# EAGLE design ETH7820 with ESP32 (EAGLE 9.0.1)
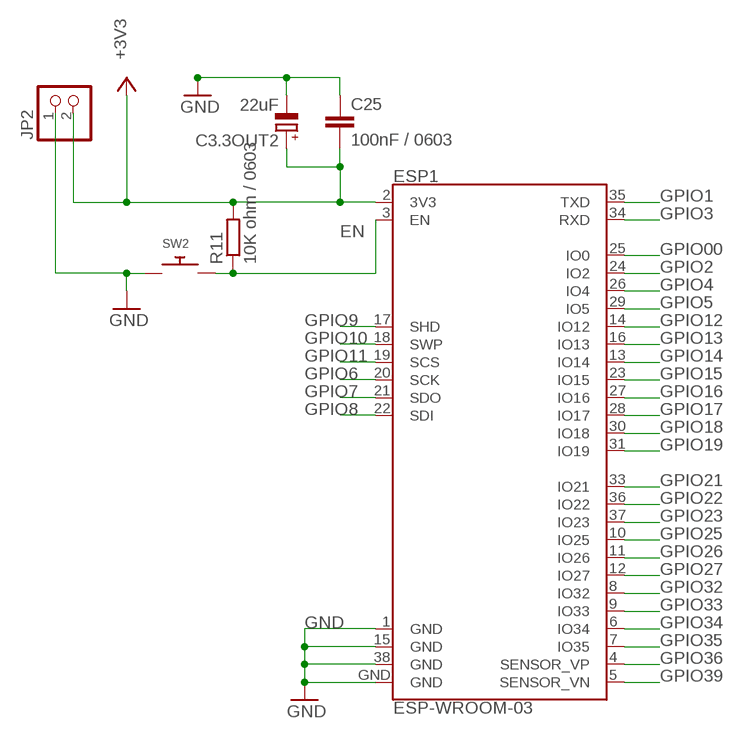
[diagram p0: schematic, sheet 1, part 1 of 2]
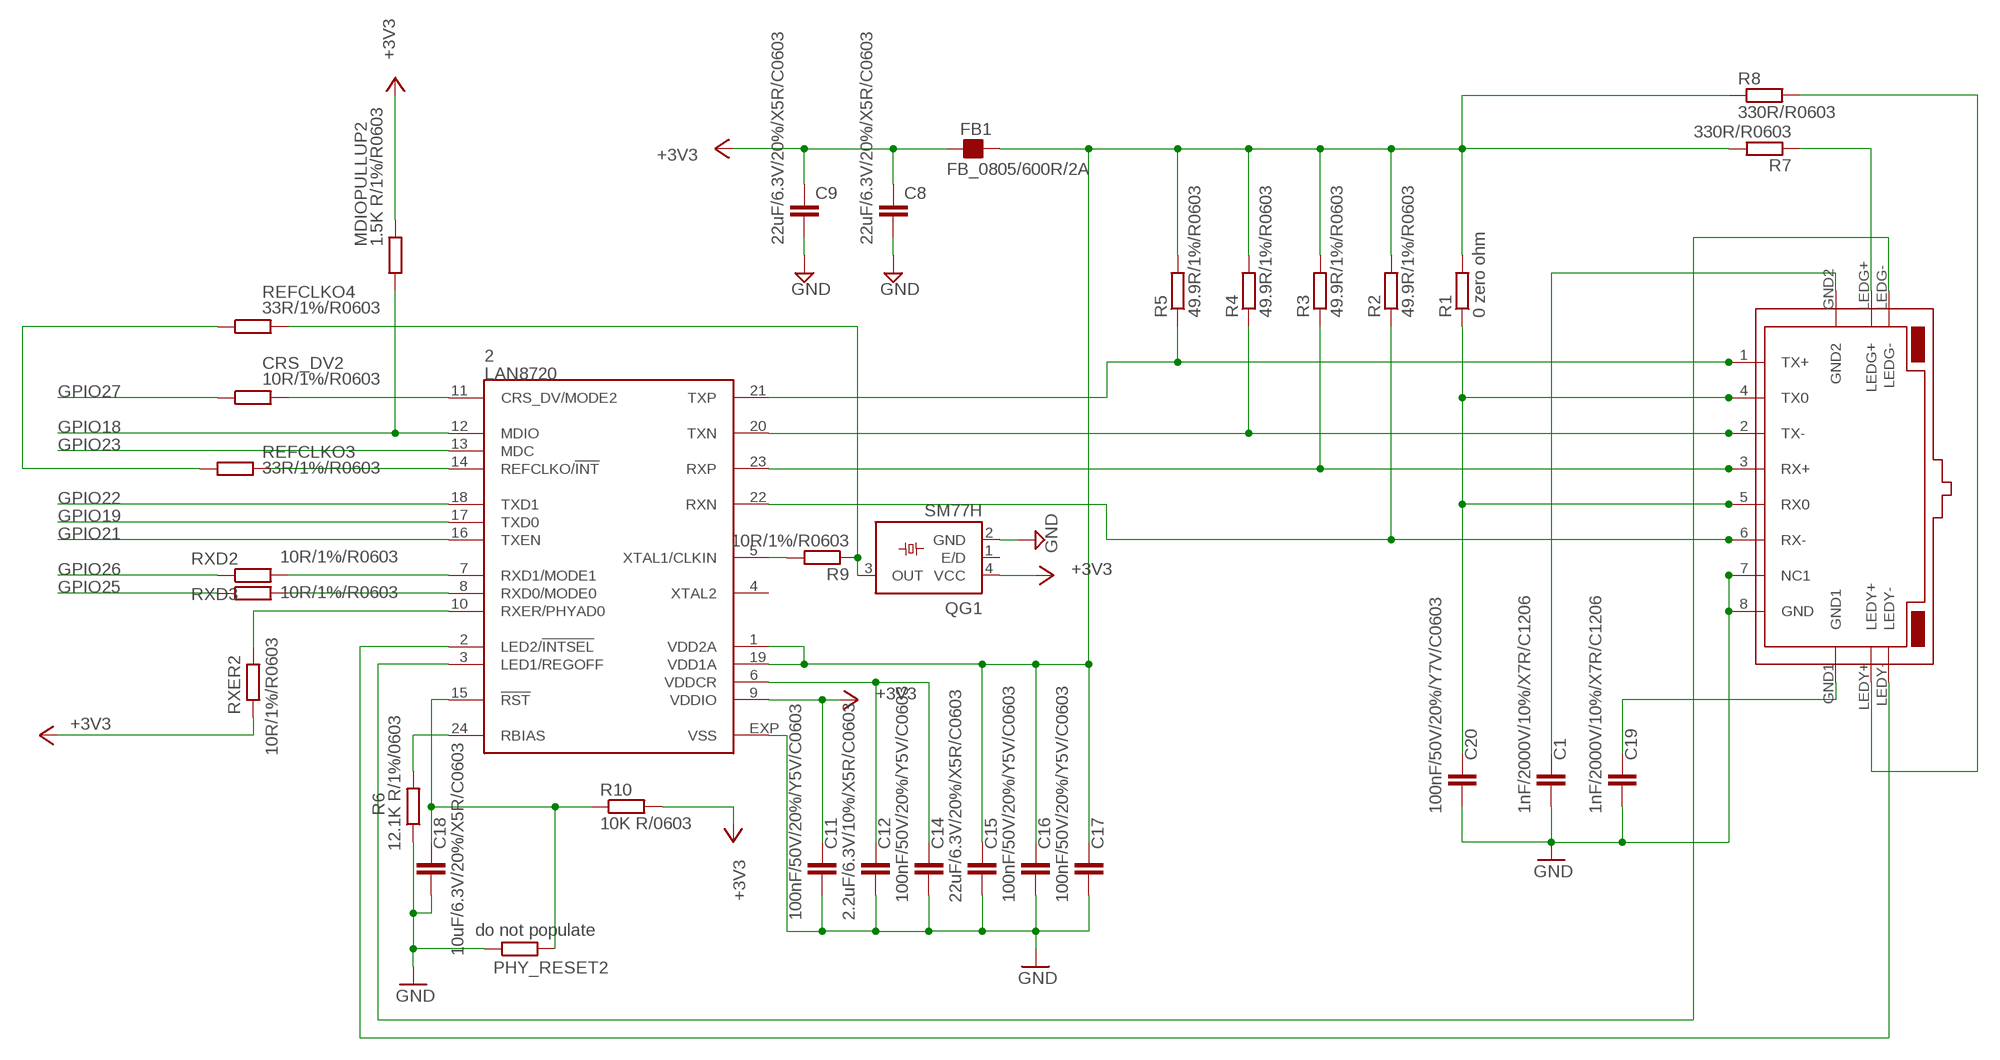
[diagram p1: schematic, sheet 1, part 2 of 2]

## Parts
2  LAN8720  [QFN24]
C1  1nF/2000V/10%/X7R/C1206  C-EUC1206  [C1206]
C3.3OUT2  22uF  CPOL-EU153CLV-0605  [153CLV-0605]
C8  22uF/6.3V/20%/X5R/C0603  C-EUC0603  [C0603]
C9  22uF/6.3V/20%/X5R/C0603  C-EUC0603  [C0603]
C11  100nF/50V/20%/Y5V/C0603  C-EUC0603  [C0603]
C12  2.2uF/6.3V/10%/X5R/C0603  C-EUC0603  [C0603]
C14  100nF/50V/20%/Y5V/C0603  C-EUC0603  [C0603]
C15  22uF/6.3V/20%/X5R/C0603  C-EUC0603  [C0603]
C16  100nF/50V/20%/Y5V/C0603  C-EUC0603  [C0603]
C17  100nF/50V/20%/Y5V/C0603  C-EUC0603  [C0603]
C18  10uF/6.3V/20%/X5R/C0603  C-EUC0603  [C0603]
C19  1nF/2000V/10%/X7R/C1206  C-EUC1206  [C1206]
C20  100nF/50V/20%/Y7V/C0603  C-EUC0603  [C0603]
C25  100nF / 0603  C-EUC0603  [C0603]
CRS_DV2  10R/1%/R0603  R-EU_R0603  [R0603]
ESP1  ESP-WROOM-03  [ESP-WROOM-03]
FB1  FB_0805/600R/2A  FB_0805  [L0805]
JP2  PINHD-1X2  [1X02]
MDIOPULLUP2  1.5K R/1%/R0603  R-EU_R0603  [R0603]
PHY_RESET2  do not populate  R-EU_R0603  [R0603]
QG1  SM77H  [SM77H]
R1  0 zero ohm  R-EU_R0603  [R0603]
R2  49.9R/1%/R0603  R-EU_R0603  [R0603]
R3  49.9R/1%/R0603  R-EU_R0603  [R0603]
R4  49.9R/1%/R0603  R-EU_R0603  [R0603]
R5  49.9R/1%/R0603  R-EU_R0603  [R0603]
R6  12.1K R/1%/0603  R-EU_R0603  [R0603]
R7  330R/R0603  R-EU_R0603  [R0603]
R8  330R/R0603  R-EU_R0603  [R0603]
R9  10R/1%/R0603  R-EU_R0603  [R0603]
R10  10K R/0603  R-EU_R0603  [R0603]
R11  10K ohm / 0603  R-EU_R0603  [R0603]
REFCLKO3  33R/1%/R0603  R-EU_R0603  [R0603]
REFCLKO4  33R/1%/R0603  R-EU_R0603  [R0603]
RJ2  RJ45-TRAFO-L  [RJ45-TRAFO-L]
RXD2  10R/1%/R0603  R-EU_R0603  [R0603]
RXD3  10R/1%/R0603  R-EU_R0603  [R0603]
RXER2  10R/1%/R0603  R-EU_R0603  [R0603]
SW2  SWITCH_PUSHBUTTONEVQ-PE  [TACT_PANA-EVQ]

## Nets
+3V3: 2.9(VDDIO) C3.3OUT2.+ C8.1 C9.1 C11.1 C25.2 ESP1.2(3V3) FB1.1 JP2.2 MDIOPULLUP2.2 QG1.4(VCC) R10.2 R11.2 RXER2.2
EN: ESP1.3(EN) R11.1 SW2.P$2
GND: 2.EXP(VSS) C1.2 C3.3OUT2.- C8.2 C9.2 C11.2 C12.2 C14.2 C15.2 C16.2 C17.2 C18.2 C19.2 C20.2 C25.1 ESP1.1(GND) ESP1.15(GND) ESP1.38(GND) ESP1.GND JP2.1 PHY_RESET2.1 QG1.2(GND) R6.1 RJ2.7(NC1) RJ2.8(GND) SW2.P$1
GPIO00: ESP1.25(IO0)
GPIO1: ESP1.35(TXD)
GPIO2: ESP1.24(IO2)
GPIO3: ESP1.34(RXD)
GPIO4: ESP1.26(IO4)
GPIO5: ESP1.29(IO5)
GPIO6: ESP1.20(SCK)
GPIO7: ESP1.21(SDO)
GPIO8: ESP1.22(SDI)
GPIO9: ESP1.17(SHD)
GPIO10: ESP1.18(SWP)
GPIO11: ESP1.19(SCS)
GPIO12: ESP1.14(IO12)
GPIO13: ESP1.16(IO13)
GPIO14: ESP1.13(IO14)
GPIO15: ESP1.23(IO15)
GPIO16: ESP1.27(IO16)
GPIO17: ESP1.28(IO17)
GPIO18: 2.12(MDIO) ESP1.30(IO18) MDIOPULLUP2.1
GPIO19: 2.17(TXD0) ESP1.31(IO19)
GPIO21: 2.16(TXEN) ESP1.33(IO21)
GPIO22: 2.18(TXD1) ESP1.36(IO22)
GPIO23: 2.13(MDC) ESP1.37(IO23)
GPIO25: ESP1.10(IO25) RXD3.1
GPIO26: ESP1.11(IO26) RXD2.1
GPIO27: CRS_DV2.1 ESP1.12(IO27)
GPIO32: ESP1.8(IO32)
GPIO33: ESP1.9(IO33)
GPIO34: ESP1.6(IO34)
GPIO35: ESP1.7(IO35)
GPIO36: ESP1.4(SENSOR_VP)
GPIO39: ESP1.5(SENSOR_VN)
N$1: 2.20(TXN) R4.1 RJ2.2(TX-)
N$2: 2.21(TXP) R5.1 RJ2.1(TX+)
N$3: 2.23(RXP) R3.1 RJ2.3(RX+)
N$4: 2.24(RBIAS) R6.2
N$5: 2.2(LED2/!INTSEL) RJ2.LEDY-
N$6: 2.22(RXN) R2.1 RJ2.6(RX-)
N$7: 2.1(VDD2A) 2.19(VDD1A) C15.1 C16.1 C17.1 FB1.2 R1.2 R2.2 R3.2 R4.2 R5.2 R7.2 R8.1
N$8: 2.6(VDDCR) C12.1 C14.1
N$9: 2.5(XTAL1/CLKIN) R9.2
N$10: 2.11(CRS_DV/MODE2) CRS_DV2.2
N$11: 2.14(REFCLKO/!INT) REFCLKO3.2
N$12: 2.7(RXD1/MODE1) RXD2.2
N$13: 2.8(RXD0/MODE0) RXD3.2
N$14: 2.10(RXER/PHYAD0) RXER2.1
N$15: 2.15(!RST) C18.1 PHY_RESET2.2 R10.1
N$16: C20.1 R1.1 RJ2.4(TX0) RJ2.5(RX0)
N$17: C19.1 RJ2.GND1
N$18: C1.1 RJ2.GND2
N$19: R7.1 RJ2.LEDG+
N$20: 2.3(LED1/REGOFF) RJ2.LEDG-
N$21: REFCLKO3.1 REFCLKO4.1
N$22: R8.2 RJ2.LEDY+
N$23: QG1.3(OUT) R9.1 REFCLKO4.2
Unconnected: 2.4(XTAL2) QG1.1(E/D)

## Library data of the parts
2 = microchip-smsc-lan8720:LAN8720: LAN8720A/LAN8720Ai Small Footprint RMII 10/100 Ethernet PHY Transceiver with HP Auto-MDIX Support from SMSC / Microchip <http://www.microchip.com>. (C) 2014 Tomasz Boleslaw CEDRO, cederom@tlen.pl, http://www.tomek.cedro.info. Version 0.1 (2014-01-04): Initial release.
C1 C8 C9 C11 C12 C14-C20 C25 = rcl:C-EU: CAPACITOR, European symbol; SPICEPREFIX: C
C3.3OUT2 = rcl:CPOL-EU: POLARIZED CAPACITOR, European symbol; SPICEPREFIX: C
CRS_DV2 MDIOPULLUP2 PHY_RESET2 R1-R11 REFCLKO3 REFCLKO4 RXD2 RXD3 RXER2 = rcl:R-EU_: RESISTOR, European symbol; SPICEPREFIX: R
ESP1 = esp32:ESP-WROOM-03
FB1 = rc-master-smd:FB_: FERRITE BEAD
JP2 = pinhead:PINHD-1X2: PIN HEADER
QG1 = crystal:SM77H: 3.3V CMOS Clock Oscillator Source: www.pletronics.com .. sm77h%203.3v.pdf; OC_FARNELL: unknown; OC_NEWARK: unknown
RJ2 = con-amphenol-rj45-ld:RJ45-TRAFO-L: RJ45 socket with integrated magnetics and LEDs Naming: Amphenol LMJ1998824110DL1T39J TME RJ45-TRAFO-L Author: Petr Kalandra <mailto:kalandrap@gmail.com> Datasheet: http://zefiryn.tme.pl/dok/zlacza/rjtrafol.PDF
SW2 = Adafruit:SWITCH_PUSHBUTTON: Buttons SOFTTOUCHSMD_SJ - Soft touch temporary push button (Super Junk Akihabara) Compatible with SKPMANE010 [Mouser: 688-SKPMAN] C&K_KSS = Digikey: KSS221GLFS

## Board
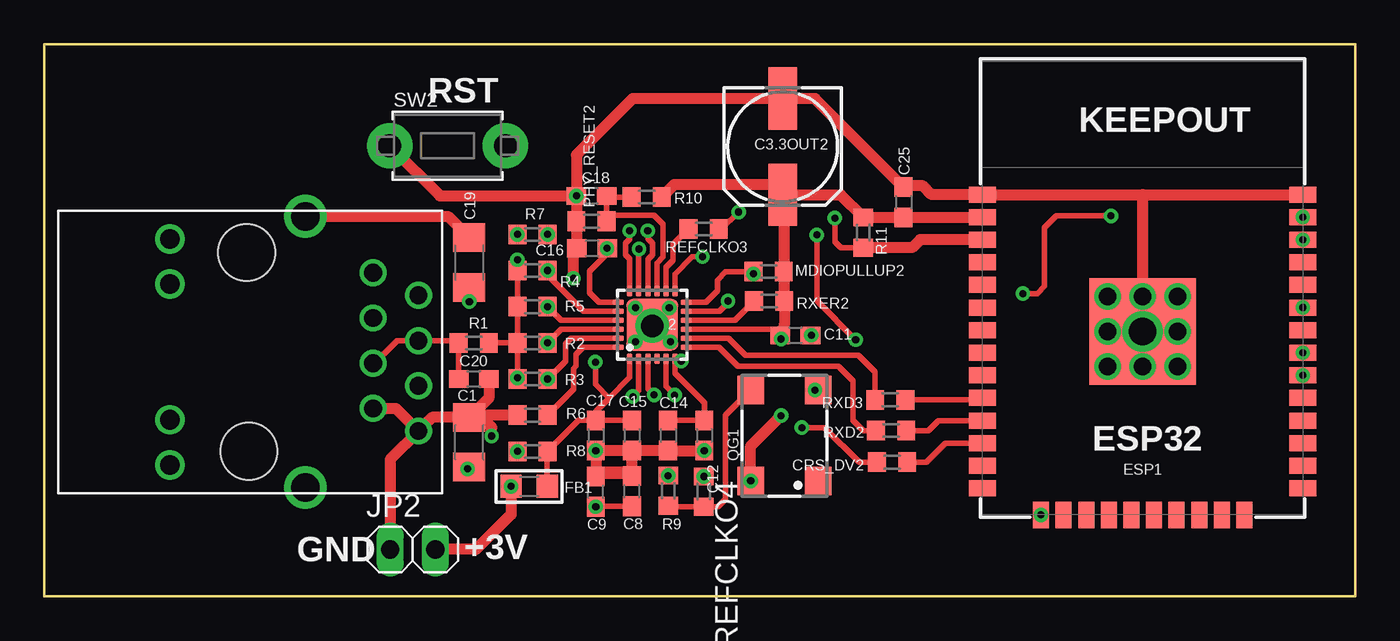
[diagram p2: board, top side]
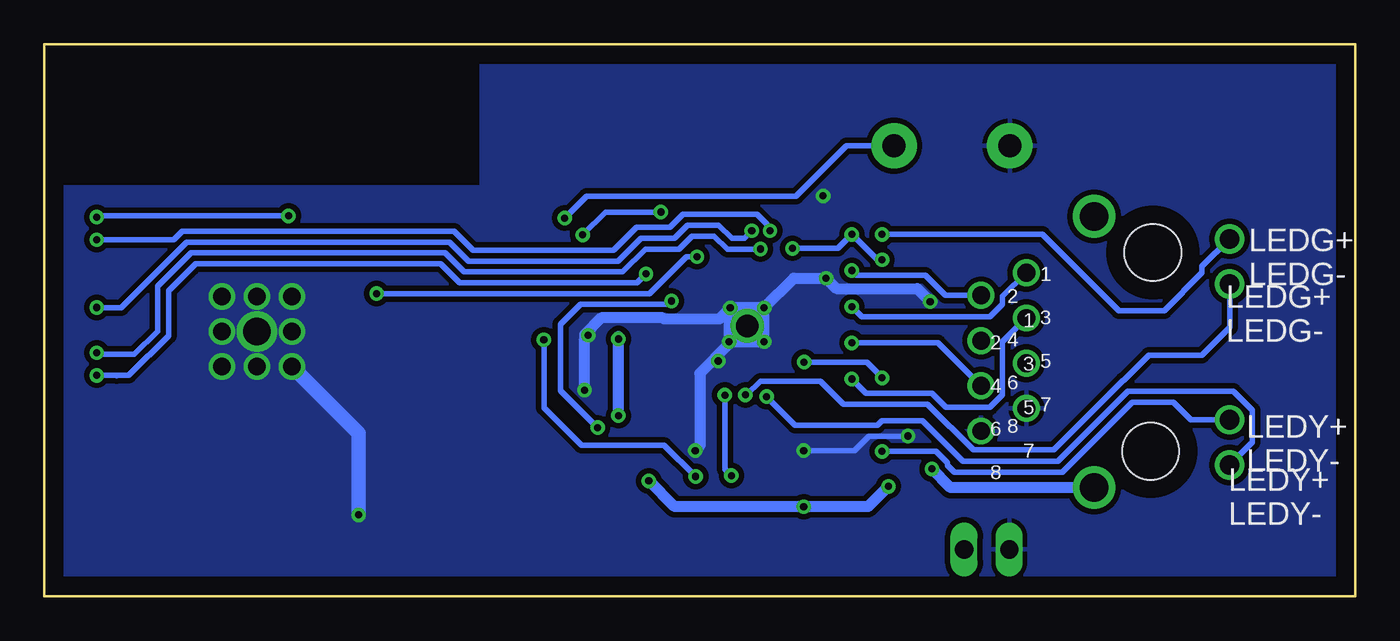
[diagram p3: board, bottom side, seen from below]

Size 73.66 x 30.99 mm. Coordinates in mm from the lower left corner, seen from the top.
Outline: 0,30.99 0,0 73.66,0 73.66,30.99 0,30.99
Copper layers (1*16): Top 0.035mm / dielectric 1.5mm / Bottom 0.035mm
Design rules "default": minimum track width 6mil, minimum drill 0.35mm, track to track 6mil, track to pad 6mil, pad to pad 6mil, via to via 6mil, smd to smd 6mil, copper to edge 40mil, drill to drill 6mil, minimum pad ring 10mil, minimum via ring 8mil, stop-mask expansion 4mil, vias tented up to drill 0mil, thermal gap 10mil

### Footprints (pad centres in the part's own frame; a part is rotated, then mirrored left to right if it is on the bottom)
QFN24 = smd 0.6 x 0.3: 1 -1.905,1.27; 2 -1.905,0.762; 3 -1.905,0.254; 4 -1.905,-0.254; 5 -1.905,-0.762; 6 -1.905,-1.27; 13 1.905,-1.27; 14 1.905,-0.762; 15 1.905,-0.254; 16 1.905,0.254; 17 1.905,0.762; 18 1.905,1.27 | smd 0.3 x 0.6: 7 -1.27,-1.905; 8 -0.762,-1.905; 9 -0.254,-1.905; 10 0.254,-1.905; 11 0.762,-1.905; 12 1.27,-1.905; 19 1.27,1.905; 20 0.762,1.905; 21 0.254,1.905; 22 -0.254,1.905; 23 -0.762,1.905; 24 -1.27,1.905 | smd 2.9 x 2.9: EXP 0,0
C1206 = smd 1.6 x 1.8: 1 -1.4,0; 2 1.4,0
153CLV-0605 = smd 3.5 x 1.6: + 2.7,0; - -2.7,0
C0603 = smd 1.1 x 1: 1 -0.85,0; 2 0.85,0
R0603 = smd 1 x 1.1: 1 -0.85,0; 2 0.85,0
ESP-WROOM-03 = smd 0.9 x 1.5: 1 7.7,9; 2 6.43,9; 3 5.16,9; 4 3.89,9; 5 2.62,9; 6 1.35,9; 7 0.08,9; 8 -1.19,9; 9 -2.46,9; 10 -3.73,9; 11 -5,9; 12 -6.27,9; 13 -7.54,9; 14 -8.81,9; 25 -8.81,-9; 26 -7.54,-9; 27 -6.27,-9; 28 -5,-9; 29 -3.73,-9; 30 -2.46,-9; 31 -1.19,-9; 32 0.08,-9; 33 1.35,-9; 34 2.62,-9; 35 3.89,-9; 36 5.16,-9; 37 6.43,-9; 38 7.7,-9 | smd 1.5 x 0.9: 15 -10.3,5.715; 16 -10.3,4.445; 17 -10.3,3.175; 18 -10.3,1.905; 19 -10.3,0.635; 20 -10.3,-0.635; 21 -10.3,-1.905; 22 -10.3,-3.175; 23 -10.3,-4.445; 24 -10.3,-5.715 | smd 6 x 6: GND 0,0
L0805 = smd 1.2 x 1.3: 1 -1.016,0; 2 1.016,0
1X02 = drill 1.016 long: 1 -1.27,0; 2 1.27,0
SM77H = smd 1.6 x 1.5: 1 -2.55,-1.9; 2 2.55,-1.9; 3 2.55,1.9; 4 -2.55,1.9
RJ45-TRAFO-L = drill 1: 1 -4.445,6.35; 2 -3.175,8.89; 3 -1.905,6.35; 4 -0.635,8.89; 5 0.635,6.35; 6 1.905,8.89; 7 3.175,6.35; 8 4.445,8.89 | drill 1.6: GND1 -7.62,2.54; GND2 7.62,2.54 | drill 1.1: LEDG+ -6.35,-5.08; LEDG- -3.81,-5.08; LEDY+ 3.81,-5.08; LEDY- 6.35,-5.08 | hole 3.2: -5.588,-0.762; 5.588,-0.635
TACT_PANA-EVQ = drill 1.3 pad 2.54: P$1 -3.25,0; P$2 3.25,0

### Placement (x,y rotation side)
2  34.16,15.24 90 top
C1  23.88,8.64 90 top
C3.3OUT2  41.49,25.25 270 top
C8  33.02,5.89 90 top
C9  30.99,5.87 90 top
C11  42.2,14.64 0 top
C12  37.08,9.02 270 top
C14  35.05,9.02 270 top
C15  33.02,9.02 270 top
C16  30.77,19.53 180 top
C17  30.99,9.02 270 top
C18  30.75,22.48 180 top
C19  23.88,18.73 270 top
C20  24.13,12.19 0 top
C25  48.29,22.12 270 top
CRS_DV2  47.64,7.52 180 top
ESP1  61.72,14.86 90 top
FB1  27.24,6.16 0 top
JP2  20.7,2.62 0 top
MDIOPULLUP2  40.7,18.22 0 top
PHY_RESET2  30.75,21.06 0 top
QG1  41.59,9.02 90 top
R1  24.13,14.22 0 top
R2  27.43,14.22 180 top
R3  27.43,12.19 180 top
R4  27.43,18.29 180 top
R5  27.43,16.26 180 top
R6  27.43,10.16 0 top
R7  27.43,20.32 0 top
R8  27.43,8.13 180 top
R9  35.05,5.92 90 top
R10  33.85,22.42 0 top
R11  46.02,20.42 90 top
REFCLKO3  37.05,20.62 180 top
REFCLKO4  37.06,5.87 270 top
RJ2  12.13,13.72 270 top
RXD2  47.59,9.3 180 top
RXD3  47.54,11.02 180 top
RXER2  40.73,16.57 0 top
SW2  22.66,25.3 0 top

### Tracks (layer width: path | path; a pad name or v marks a point on that pad's centre or on a via)
+3V3  (via drill 0.4)
  Top 0.152: C11.1 41.4,14.64 v41.4,14.44
  Top 0.305: C8.1 31.01,5.04 C9.1 | v41.4,14.44 41.31,14.99 2.9
  Top 0.406: 41.58,15.25 41.35,15.02 v41.4,14.44
  Top 0.61: 41.58,15.25 RXER2.2 41.55,16.6 MDIOPULLUP2.2 41.55,22.48 | QG1.4 39.69,8.43 v41.4,10.14 | C3.3OUT2.+ 41.55,22.48 | C25.2 R11.2 44.75,22.55 C3.3OUT2.+ | C25.2 52.71,21.27 ESP1.2 | 41.48,22.41 41.55,22.48 | R10.2 35.39,23.11 41.58,23.11 41.58,22.64 C3.3OUT2.+ | FB1.1 26.23,4.58 24.26,2.62 JP2.2
  Top 0.813: C25.2
  Bottom 0.61: v41.4,10.14 41.4,14.59 v41.4,14.44 | FB1.1 27.37,5.02 C9.1 38.24,5.02 QG1.4
  other vias: 26.23,6.16 39.69,6.47 30.99,5.02 39.69,6.47
EN  (via drill 0.4)
  Top 0.305: R11.1 44.77,19.57 44.43,19.91 v44.43,21.23
  Top 0.61: ESP1.3 49.23,20.02 48.78,19.57 R11.1
  Bottom 0.305: v44.43,21.23 43.21,22.45 31.42,22.45 28.57,25.3 SW2.P$2
GND  (via drill 0.4, 1, 1.27, 1.52)
  Top 0.152: C17.2 30.7,7.87 | C11.2 v43.1,14.66
  Top 0.305: C1.2 24.43,10.04 24.57,10.04 | 2.EXP v33.21,16.19 | 2.EXP 34.16,15.3 35.05,16.19 | 2.EXP 35.05,14.35 v35.18,14.29 | 2.EXP v33.21,14.29 | ESP1.GND v59.75,16.83 | ESP1.GND v59.75,12.89 | ESP1.GND v59.75,14.86 | ESP1.GND v61.72,16.83 61.72,17.08 | ESP1.GND v61.72,12.89 | 2.EXP v34.16,15.18 | ESP1.GND v63.69,14.86 | ESP1.GND v63.69,12.89 | QG1.2 v43.3,11.57 | C14.2 35.24,8.17 | C17.2 30.99,8.13 30.99,6.99 C9.2 C8.2 33.02,6.99 C15.2 C17.2
  Top 0.61: 35.24,8.17 C12.2 | C14.2 C15.2 | C15.2 31.03,8.17 30.99,8.13 | C17.2 30.99,6.99 | C9.2 31.15,6.99 33.02,6.99 | C8.2 C15.2 | v63.69,16.83 ESP1.GND 61.72,22.56 | 30,19.61 C16.2 29.9,19.56 | 29.9,19.56 PHY_RESET2.1 C18.2 | 48.35,23.04 49.38,23.04 49.86,22.56 ESP1.1 61.72,22.56 | 61.72,22.56 ESP1.38 | v29.73,17.86 29.73,19.39 29.9,19.56 | C25.1 43.31,27.95 C3.3OUT2.- 33.05,27.95 29.9,24.79 C18.2 | SW2.P$1 22.23,22.48 C18.2 | RJ2.8 21.78,10.04 C1.2 24.98,11.14 C20.2 | RJ2.8 19.43,7.68 JP2.1 | RJ2.7 19.75,10.54 RJ2.8 | R6.1 24.56,10.16 24.43,10.04 | v25.13,8.99 25.13,9.47 24.57,10.04 | v23.88,16.54 C19.2
  Top 0.813: 61.85,17.21 61.72,17.08 | 48.35,23.04 C25.1
  Bottom 0.127: v35.18,14.29 35.18,16.15 35.18,16.19 v35.12,16.19 35.03,16.19
  Bottom 0.305: 33.4,16.13 v33.21,16.19 33.62,16.13 | 35.22,14.74 35.05,14.57 v35.18,14.29 | 59.72,12.86 v59.75,12.89 | 29.96,8.17 C17.2 28.14,8.17 27.32,8.99 v25.13,8.99
  Bottom 0.406: 35.5,15.72 35.03,16.19
  Bottom 0.61: v35.18,14.29 33.27,16.19 v33.21,16.19 | v35.18,14.29 35.18,14.16 36.83,12.51 36.83,8.42 C12.2 | v33.21,16.19 31.55,17.86 v29.73,17.86 29.15,17.27 24.61,17.27 v23.88,16.54 | v43.3,11.57 43.3,14.46 | 43.3,14.46 v43.1,14.66 | 43.3,14.46 43.3,14.68 42.37,15.62 38.9,15.62 38.84,15.56 35.75,15.56 v35.12,16.19 35.18,16.13 v35.18,14.29 | v33.21,16.19 35.03,16.19 | 35.03,16.19 35.14,16.19 35.18,16.15 | v35.18,14.29 v33.21,14.29 | v33.21,14.29 v33.21,16.19 | v33.21,14.29 35.03,16.1 35.03,16.19
  Bottom 0.813: ESP1.15 56.01,9.14 59.72,12.86
  other vias: 35.79,13.21 37.08,8.17 29.9,22.48 30.99,8.17 56.01,4.56 61.72,14.86
  pour Bottom (isolate 0.305): -0.18,31.9 -0.18,-2.26 75.79,-2.26 75.79,23.01 49.15,23.01 49.15,32.31 -0.1,32.31
GPIO00
  Top 0.305: ESP1.25 70.8,5.97
GPIO1
  Top 0.61: 71.06,18.75 ESP1.35
GPIO4
  Top 0.305: ESP1.26 70.77,7.37
GPIO16
  Top 0.305: 70.74,8.57 ESP1.27
GPIO18  (via drill 0.4)
  Top 0.305: MDIOPULLUP2.1 39.63,18 | MDIOPULLUP2.1 v39.85,18.1 | MDIOPULLUP2.1 38.29,18.22 37.82,17.75 37.82,17.14 37.19,16.51 2.12
  Bottom 0.305: 69.6,12.38 69.61,12.4 | 69.61,12.4 ESP1.30 | 39.98,18.22 v39.85,18.1 40.35,17.6 50.33,17.6 51.4,18.67 65.16,18.67 65.39,18.44 65.58,18.26 66.69,17.14 66.69,14.64 68.93,12.4 69.61,12.4
  other vias: 70.72,12.4
GPIO19  (via drill 0.4)
  Top 0.305: v33.41,19.49 33.4,19.48 2.17
  Bottom 0.305: ESP1.31 70.64,13.58 68.6,13.58 67.3,14.89 67.3,17.4 65.77,18.93 65.64,19.05 65.42,19.28 51.15,19.28 50.92,19.05 50.85,18.98 50.08,18.21 41.16,18.21 39.88,19.49 38.01,19.49 37.28,20.23 36.02,20.23 35.28,19.49 v33.41,19.49
  other vias: 70.72,13.67
GPIO21  (via drill 0.4)
  Top 0.305: 2.16 33.91,18.92 34.17,19.18 34.17,19.81 33.91,20.07 v33.91,20.52
  Bottom 0.305: ESP1.33 70.71,16.19 | 70.09,16.21 ESP1.33 | ESP1.33 69.35,16.21 65.67,19.89 50.89,19.89 49.83,18.82 41.41,18.82 40.13,20.1 38.26,20.1 37.53,20.84 35.76,20.84 35.03,20.1 34.33,20.1 v33.91,20.52
  other vias: 70.72,16.21
GPIO22  (via drill 0.4)
  Top 0.305: v32.88,20.52 32.89,20.51 32.89,20.05 32.66,19.81 32.66,19.18 32.89,18.94 2.18
  Bottom 0.305: ESP1.36 66.4,20.02 65.92,20.5 50.64,20.5 49.57,19.43 41.67,19.43 40.38,20.71 38.52,20.71 37.78,21.45 33.62,21.45 33.05,20.88 33.05,20.69 v32.88,20.52
  other vias: 70.72,20.02
GPIO23  (via drill 0.4)
  Top 0.305: 2.13 35.43,18.09 36.4,19.05 36.4,19.06 v36.98,19.06 | v54.99,16.99 55.8,16.99 56.21,17.4 56.21,20.7 56.87,21.36 v59.94,21.36
  Bottom 0.305: 70.64,21.37 ESP1.37 70.65,21.36 v59.94,21.36 | v36.98,19.06 37.58,19.06 39.65,16.99 v54.99,16.99
  other vias: 70.72,21.29
GPIO25
  Top 0.305: RXD3.1 52.62,11.02 ESP1.10
GPIO26
  Top 0.305: ESP1.11 50.25,9.86 49.68,9.3 RXD2.1
GPIO27
  Top 0.305: ESP1.12 50.65,8.59 49.58,7.52 CRS_DV2.1
GPIO36
  Top 0.305: 52.77,18.8 ESP1.4
GPIO39
  Top 0.61: 52.74,17.46 ESP1.5
N$1  (via drill 0.4)
  Top 0.305: R4.1 28.28,18.01 30.29,16 2.20
  Bottom 0.305: 28.16,18.17 R4.1 28.03,18.03 24.15,18.03 23.01,16.89 RJ2.2
  other vias: 28.28,18.29
N$2  (via drill 0.4)
  Top 0.305: 2.21 29.04,15.49 R5.1
  Bottom 0.305: RJ2.1 19.81,16.83 19.81,16.39 20.52,15.68 27.71,15.68 R5.1
  other vias: 28.28,16.26
N$3  (via drill 0.4)
  Top 0.305: R3.1 29.27,13.18 29.27,14.16 29.59,14.48 2.23
  Bottom 0.305: RJ2.3 19.81,14.29 19.81,11.31 20.52,10.6 22.98,10.6 23.77,11.39 27.48,11.39 R3.1
  other vias: 28.28,12.19
N$4
  Top 0.305: R6.2 29.73,11.61 29.73,12.78 29.88,12.93 29.88,13.58 30.28,13.97 2.24
N$5  (via drill 0.4)
  Top 0.305: 2.2 33.4,11.53 v33.07,11.2
  Bottom 0.305: RJ2.LEDY- 5.77,8.65 5.77,10.44 6.83,11.51 12.77,11.51 16.71,7.56 22.03,7.56 24.32,9.85 26.58,9.85 26.84,9.6 31.47,9.6 v33.07,11.2
N$6  (via drill 0.4)
  Top 0.152: 28.33,14.27 R2.1
  Top 0.305: 28.33,14.27 29.04,14.99 2.22
  Bottom 0.305: RJ2.6 23.43,14.22 R2.1
  other vias: 28.28,14.22
N$7  (via drill 0.4)
  Top 0.305: C15.1 C17.1 | 30.63,9.87 C17.1 | FB1.2 28.26,8.1 R8.1 30.02,9.87 C17.1 | R3.2 v26.58,12.26 R2.2 | R2.2 R5.2 R4.2 v26.58,18.89 | R1.2 R2.2 | 2.19 31.17,16.51 30.63,17.04 30.63,18.24 31.62,19.23 C16.1 | 2.1 32.89,12.29 31.72,11.12 | C17.1 30.99,10.39 31.72,11.12 | v30.96,13.14 30.96,11.89 31.72,11.12
  Bottom 0.305: v30.96,13.14 27.43,13.14 26.58,12.3 v26.58,12.26 | C16.1 29.07,19.53 R7.2 26.86,18.89 v26.58,18.89
  other vias: 31.62,19.53 28.28,20.32
N$8
  Top 0.305: C14.1 C12.1 37.08,10.87 35.43,12.52 2.6
N$9  (via drill 0.4)
  Top 0.305: 2.5 34.93,11.79 v35.42,11.29
  Bottom 0.305: v35.42,11.29 35.42,8.28 35.42,7.14 R9.2
  other vias: 35.05,6.77
N$10  (via drill 0.4)
  Top 0.305: v42.57,9.46 43.85,9.46 45.8,7.52 CRS_DV2.2 | v38.42,16.57 38.42,16.47 37.95,16 2.11
  Bottom 0.305: v42.57,9.46 44.65,11.54 44.65,15.27 43.54,16.38 38.61,16.38 v38.42,16.57
N$11
  Top 0.305: 2.14 34.93,18.47 35.33,18.87 35.33,19.76 REFCLKO3.2
N$12
  Top 0.305: 2.7 37.92,13.97 38.99,12.9 44.63,12.9 45.44,12.09 45.44,9.88 46.03,9.3 RXD2.2
N$13
  Top 0.305: 2.8 38.46,14.48 39.4,13.54 45.75,13.54 46.69,12.6 RXD3.2
N$14
  Top 0.305: 2.10 38.8,15.49 RXER2.1
N$15
  Top 0.305: 2.15 34.42,18.71 34.77,19.06 34.77,20.12 | 34.77,20.12 | 34.77,20.12 34.77,20.88 34.27,21.38 31.65,21.38 31.6,21.44 | 31.6,21.44 C18.1 31.66,22.41 R10.1 | 31.6,21.44 PHY_RESET2.2
N$16
  Top 0.305: RJ2.5 18.54,13.08 19.81,14.35 RJ2.4 23.15,14.35 R1.1 C20.1
N$17
  Top 0.61: RJ2.GND1 19.1,21.34 22.67,21.34 C19.1
N$18  (via drill 0.4)
  Top 0.152: v23.78,7.14 C1.1
  Bottom 0.61: RJ2.GND2 17.73,6.1 22.74,6.1 v23.78,7.14
N$19  (via drill 0.4)
  Bottom 0.305: R7.1 17.57,20.32 13.28,16.03 11.18,16.03 10.98,16.03 10.73,16.03 8.6,18.16 8.6,18.52 RJ2.LEDG+
  other vias: 26.58,20.32
N$20  (via drill 0.4)
  Top 0.305: 2.3 33.91,11.65 v34.27,11.3
  Bottom 0.305: RJ2.LEDG- 7.05,15.11 8.62,13.54 11.58,13.54 13.01,12.12 13.02,12.12 16.92,8.21 21.46,8.21 24.03,10.78 28.75,10.78 30.03,12.06 33.43,12.06 34.19,11.3 v34.27,11.3
N$21  (via drill 0.4)
  Top 0.305: REFCLKO4.1 37.15,6.81 | v45.59,14.4 43.41,16.59 v43.41,20.29 | v39.01,21.57 38.07,20.62 REFCLKO3.1
  Bottom 0.305: v45.59,14.4 45.59,10.59 43.48,8.48 38.83,8.48 REFCLKO4.1 | v43.41,20.29 42.13,21.57 v39.01,21.57
  other vias: 37.06,6.72
N$22  (via drill 0.4)
  Bottom 0.305: 26.55,8.23 R8.2 23.55,8.13 22.92,7.5 22.92,7.36 22.51,6.95 16.46,6.95 12.51,10.9 10.22,10.9 9.23,9.91 RJ2.LEDY+
  other vias: 26.58,8.13
N$23
  Top 0.305: R9.1 35.1,5.02 REFCLKO4.2 37.86,5.02 38.28,5.44 38.28,10.15 QG1.3

### Text on the board
bNames: LEDG+ / LEDG- | 1 / 2 / 3 / 4 / 5 / 6 / 7 / 8 | LEDY+ / LEDY-
_tNames: RST | KEEPOUT | ESP32 | +3V | GND
_bNames: LEDG+ / LEDG- | 1 / 2 / 3 / 4 / 5 / 6 / 7 / 8 | LEDY+ / LEDY-